# EAGLE schematic board_L2 (EAGLE 4.16)
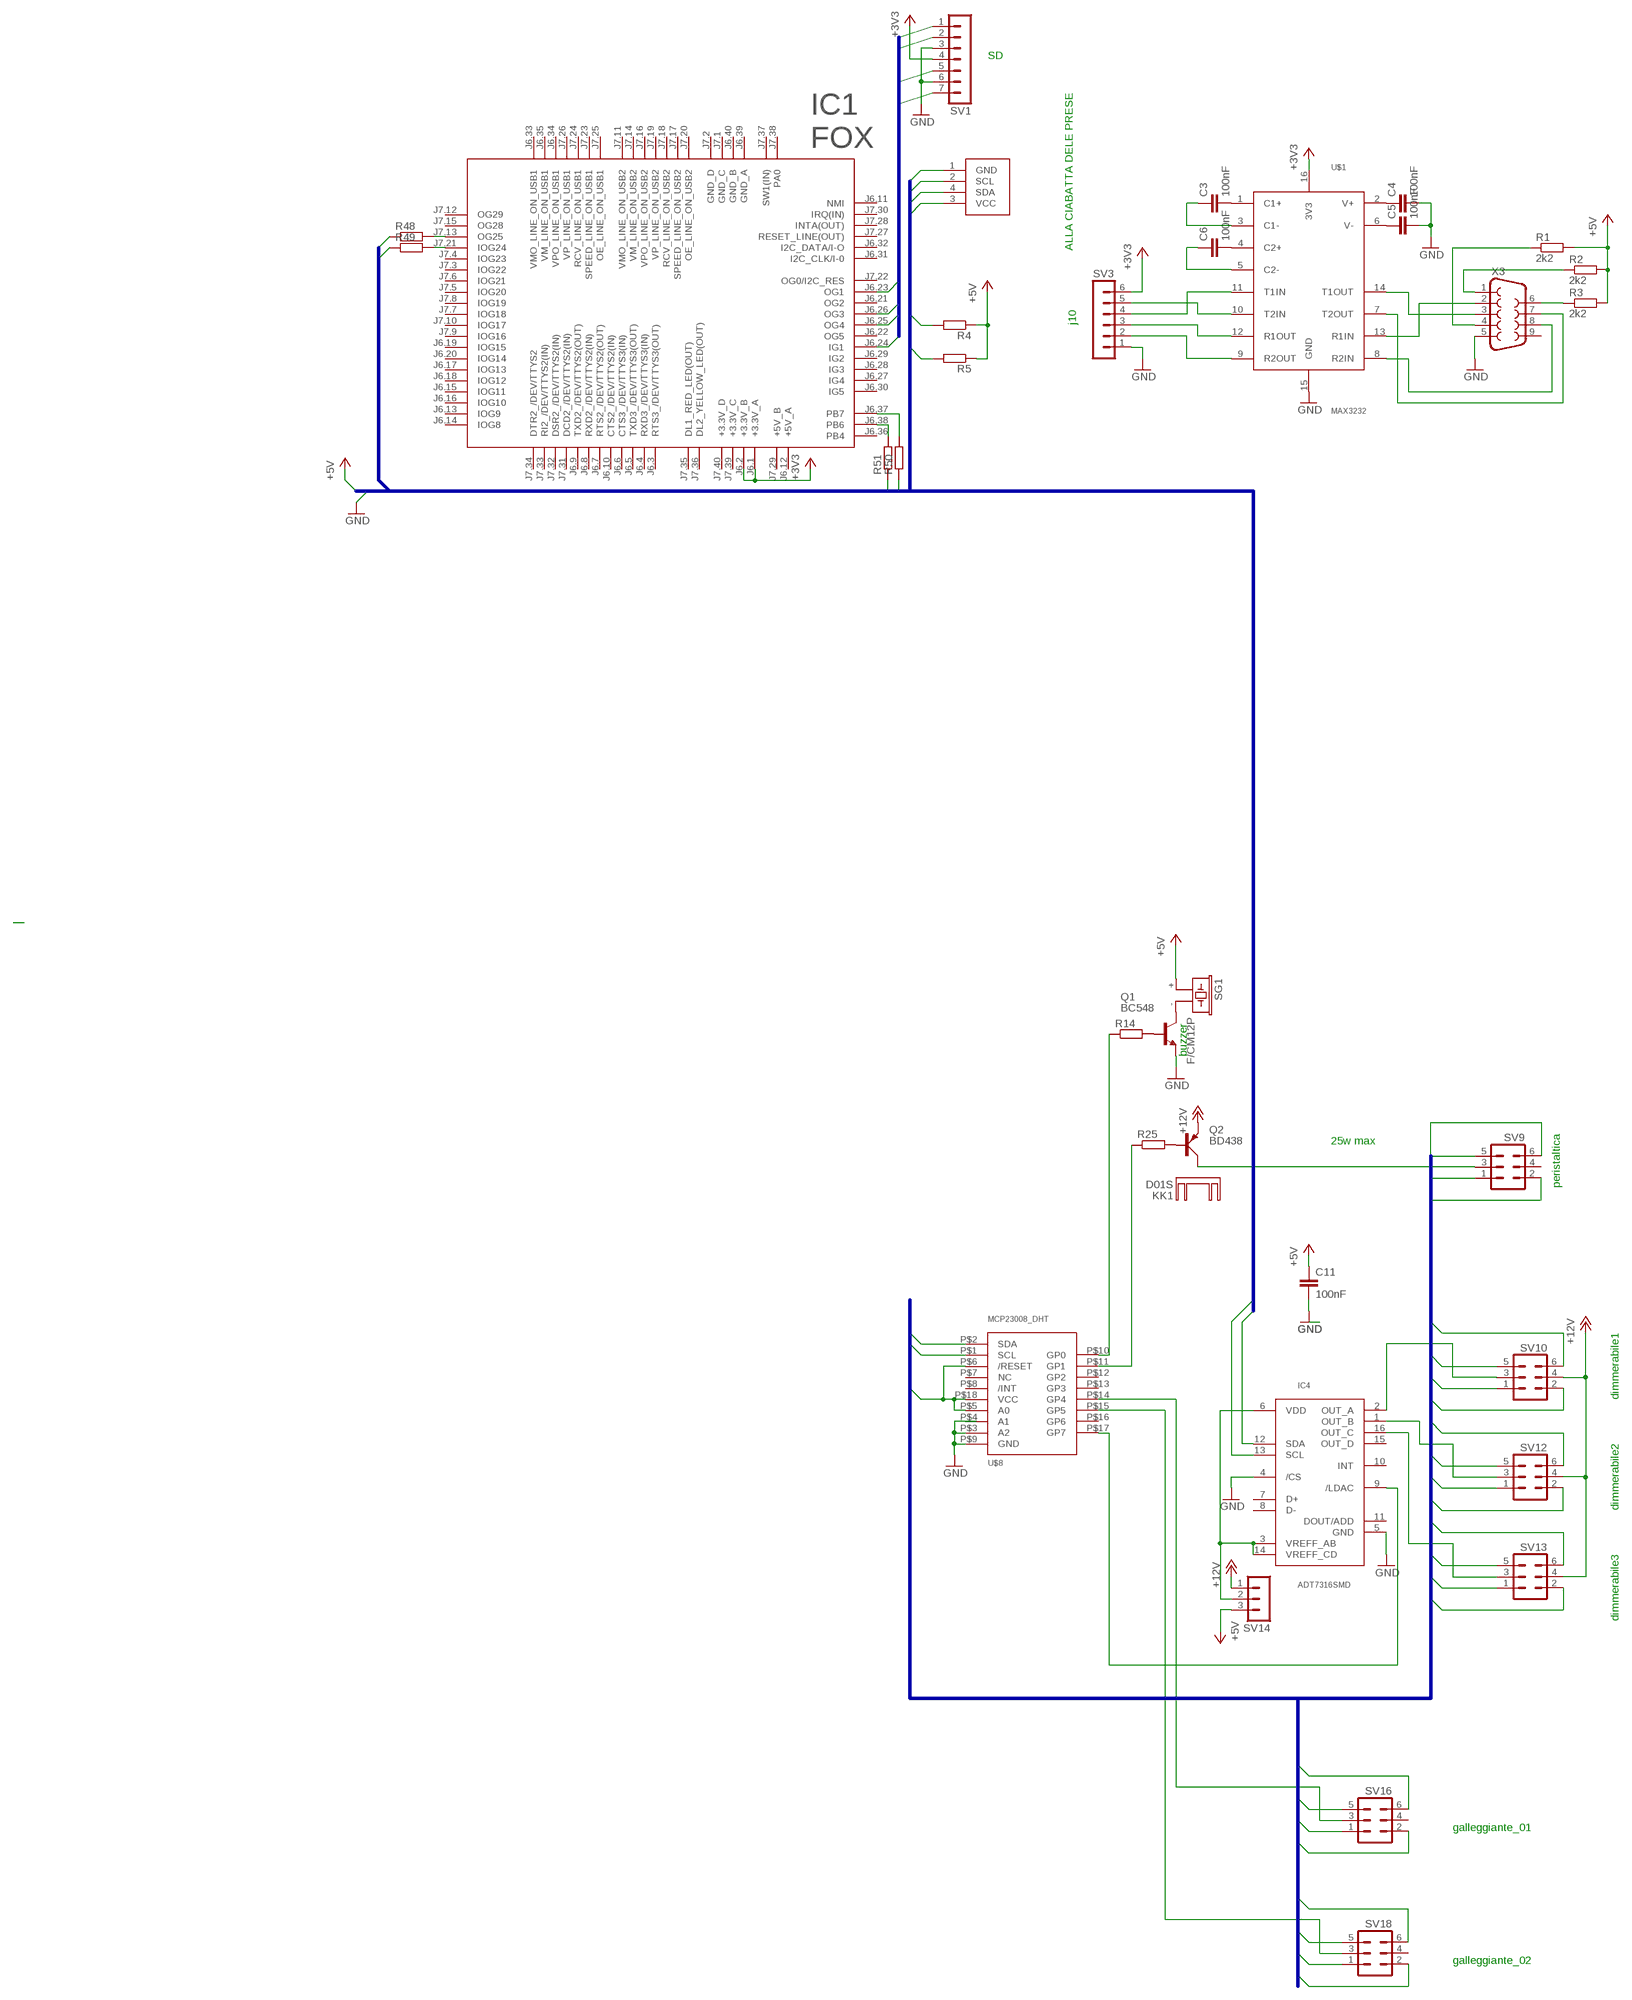
[diagram p0: schematic, sheet 1]

## Parts
C3  100nF  C-EUC0402  [C0402]
C4  100nF  C-EUC0402  [C0402]
C5  100nF  C-EUC0402  [C0402]
C6  100nF  C-EUC0402  [C0402]
C11  100nF  C-EUC0402  [C0402]
IC1  FOX  [FOX]
IC4  ADT7316SMD  [ADT7318SMD]
KK1  D01S  [D01S]
Q1  BC548  [TO92-EBC]
Q2  BD438  [TO126AV]
R1  2k2  R-EU_0207/10  [0207/10]
R2  2k2  R-EU_0207/10  [0207/10]
R3  2k2  R-EU_0207/10  [0207/10]
R4  R-EU_R0805  [R0805]
R5  R-EU_R0805  [R0805]
R14  R-EU_0309/V  [0309V]
R25  R-EU_0207/5V  [0207/5V]
R48  R-EU_R0805  [R0805]
R49  R-EU_R0805  [R0805]
R50  R-EU_R0805  [R0805]
R51  R-EU_R0805  [R0805]
SG1  F/CM12P  [F/CM12P]
SV1  MA07-1  [MA07-1]
SV3  MA06-1  [MA06-1]
SV9  MA03-2  [MA03-2]
SV10  MA03-2  [MA03-2]
SV12  MA03-2  [MA03-2]
SV13  MA03-2  [MA03-2]
SV14  MA03-1  [MA03-1]
SV16  MA03-2  [MA03-2]
SV18  MA03-2  [MA03-2]
U$1  MAX3232  [MAX3232]
U$8  MCP23008_DHT  [MCP23008_DHT]
U$13  J-I2C  [J-I2C]
X3  F09H  [F09H]

## Nets
5V: SV9.5 SV10.5 SV12.5 SV13.5 SV16.5 SV18.5 U$8.P$5(A0) U$8.P$6(/RESET) U$8.P$18(VCC) U$13.3(VCC) ; supply symbol labelled +5V
+3V3: IC1.J6.1(+3.3V_A) IC1.J6.2(+3.3V_B) SV1.4 SV3.6 U$1.16(3V3)
+5V: C11.1 R1.2 R2.2 R3.2 R4.1 R5.1 SG1.+ SV14.3
+12V: Q2.E SV10.4 SV12.4 SV13.4 SV14.1
GND: C4.2 C5.2 C11.2 IC4.4(/CS) IC4.5(GND) Q1.E SV1.3 SV1.6 SV3.1 SV9.1 SV10.1 SV12.1 SV13.1 SV16.1 SV18.1 U$1.15(GND) U$8.P$3(A2) U$8.P$9(GND) U$13.1(GND) X3.5
N$1: R14.1 U$8.P$10(GP0)
N$11: SV18.3 U$8.P$15(GP5)
N$14: Q2.B R25.2
N$15: IC1.J7.13(OG25) R48.2
N$16: R25.1 U$8.P$11(GP1)
N$17: IC4.16(OUT_C) SV13.3
N$18: SV16.3 U$8.P$14(GP4)
N$19: Q2.C SV9.3
N$20: Q1.C SG1.-
N$21: IC4.3(VREFF_AB) IC4.6(VDD) IC4.14(VREFF_CD) SV14.2
N$23: IC4.2(OUT_A) SV10.3
N$25: IC4.9(/LDAC) U$8.P$17(GP7)
N$26: Q1.B R14.2
N$27: C3.2 U$1.1(C1+)
N$36: U$1.14(T1OUT) X3.3
N$39: C6.2 U$1.4(C2+)
N$40: U$1.13(R1IN) X3.2
N$41: C5.1 U$1.6(V-)
N$42: C3.1 U$1.3(C1-)
N$43: C4.1 U$1.2(V+)
N$44: C6.1 U$1.5(C2-)
N$45: U$1.8(R2IN) X3.8
N$46: U$1.7(T2OUT) X3.7
N$47: R2.1 X3.1
N$48: R1.1 X3.4
N$49: R3.1 X3.6
N$50: IC4.1(OUT_B) SV12.3
N$53: IC1.J7.21(IOG24) R49.2
N$54: IC1.J6.38(PB6) R51.2
N$55: SV3.4 U$1.11(T1IN)
N$56: SV3.3 U$1.12(R1OUT)
N$57: SV3.5 U$1.10(T2IN)
N$59: SV3.2 U$1.9(R2OUT)
N$61: IC1.J6.37(PB7) R50.2
SCL: IC4.13(SCL) R5.2 R48.1 R50.1 SV9.2 SV10.2 SV12.2 SV13.2 SV16.2 SV18.2 U$8.P$1(SCL) U$13.2(SCL)
SD1: IC1.J6.26(OG3) SV1.1
SD2: IC1.J6.25(OG4) SV1.2
SD5: IC1.J6.23(OG1) SV1.5
SD7: IC1.J6.24(IG1) SV1.7
SDA: IC4.12(SDA) R4.2 R49.1 R51.1 SV9.6 SV10.6 SV12.6 SV13.6 SV16.6 SV18.6 U$8.P$2(SDA) U$13.4(SDA)
Unconnected: IC1.J6.3(RTS3_/DEV/TTYS3(OUT)) IC1.J6.4(RXD3_/DEV/TTYS3(IN)) IC1.J6.5(TXD3_/DEV/TTYS3(OUT)) IC1.J6.6(CTS3_/DEV/TTYS3(IN)) IC1.J6.7(RTS2_/DEV/TTYS2(OUT)) IC1.J6.8(RXD2_/DEV/TTYS2(IN)) IC1.J6.9(TXD2_/DEV/TTYS2(OUT)) IC1.J6.10(CTS2_/DEV/TTYS2(IN)) IC1.J6.11(NMI) IC1.J6.12(+5V_A) IC1.J6.13(IOG9) IC1.J6.14(IOG8) IC1.J6.15(IOG11) IC1.J6.16(IOG10) IC1.J6.17(IOG13) IC1.J6.18(IOG12) IC1.J6.19(IOG15) IC1.J6.20(IOG14) IC1.J6.21(OG2) IC1.J6.22(OG5) IC1.J6.27(IG4) IC1.J6.28(IG3) IC1.J6.29(IG2) IC1.J6.30(IG5) IC1.J6.31(I2C_CLK/I-0) IC1.J6.32(I2C_DATA/I-O) IC1.J6.33(VMO_LINE_ON_USB1) IC1.J6.34(VPO_LINE_ON_USB1) IC1.J6.35(VM_LINE_ON_USB1) IC1.J6.36(PB4) IC1.J6.39(GND_A) IC1.J6.40(GND_B) IC1.J7.1(GND_C) IC1.J7.2(GND_D) IC1.J7.3(IOG22) IC1.J7.4(IOG23) IC1.J7.5(IOG20) IC1.J7.6(IOG21) IC1.J7.7(IOG18) IC1.J7.8(IOG19) IC1.J7.9(IOG16) IC1.J7.10(IOG17) IC1.J7.11(VMO_LINE_ON_USB2) IC1.J7.12(OG29) IC1.J7.14(VM_LINE_ON_USB2) IC1.J7.15(OG28) IC1.J7.16(VPO_LINE_ON_USB2) IC1.J7.17(SPEED_LINE_ON_USB2) IC1.J7.18(RCV_LINE_ON_USB2) IC1.J7.19(VP_LINE_ON_USB2) IC1.J7.20(OE_LINE_ON_USB2) IC1.J7.22(OG0/I2C_RES) IC1.J7.23(SPEED_LINE_ON_USB1) IC1.J7.24(RCV_LINE_ON_USB1) IC1.J7.25(OE_LINE_ON_USB1) IC1.J7.26(VP_LINE_ON_USB1) IC1.J7.27(RESET_LINE(OUT)) IC1.J7.28(INTA(OUT)) IC1.J7.29(+5V_B) IC1.J7.30(IRQ(IN)) IC1.J7.31(DCD2_/DEV/TTYS2(IN)) IC1.J7.32(DSR2_/DEV/TTYS2(IN)) IC1.J7.33(RI2_/DEV/TTYS2(IN)) IC1.J7.34(DTR2_/DEV/TTYS2) IC1.J7.35(DL1_RED_LED(OUT)) IC1.J7.36(DL2_YELLOW_LED(OUT)) IC1.J7.37(SW1(IN)) IC1.J7.38(PA0) IC1.J7.39(+3.3V_C) IC1.J7.40(+3.3V_D) IC4.7(D+) IC4.8(D-) IC4.10(INT) IC4.11(DOUT/ADD) IC4.15(OUT_D) SV9.4 SV16.4 SV18.4 U$8.P$4(A1) U$8.P$7(NC) U$8.P$8(/INT) U$8.P$12(GP2) U$8.P$13(GP3) U$8.P$16(GP6) X3.9

## Buses
BUS:SDA,SCL,GND,5V
SD[1..7]

## Notes on the sheet
- SD
- ALLA CIABATTA DELE PRESE
- j10
- buzzer
- peristaltica
- 25w max
- dimmerabile1
- dimmerabile2
- dimmerabile3
- galleggiante_01
- galleggiante_02

## Library data of the parts
C3-C6 C11 = rcl:C-EU: CAPACITOR, European symbol
IC1 = aggiunte:FOX: FOXBOARD Un sistema linux embedded completo www.acmesystem.it
IC4 = aggiunte:ADT7316SMD: ADT7318 smd I2C DAC 4 Ch
KK1 = heatsink:D01S: HEATSINK distributor Schukat
Q1 = transistor-npn:BC548*: NPN Transistor
Q2 = transistor-power:BD438: PNP TRANSISTOR
R1-R5 R14 R25 R48-R51 = rcl:R-EU_: RESISTOR, European symbol
SG1 = buzzer:F/CM12P: BUZZER Source: Buerklin
SV1 = con-lstb:MA07-1: PIN HEADER
SV3 = con-lstb:MA06-1: PIN HEADER
SV9 SV10 SV12 SV13 SV16 SV18 = con-lstb:MA03-2: PIN HEADER
SV14 = con-lstb:MA03-1: PIN HEADER
U$1 = aggiunte:MAX3232: MAX3232 3.3v rs232 transceiver @ 5v supply
U$8 = aggiunte:MCP23008_DHT: MCP23008 I2C EXPANDER 8 Ch
U$13 = aggiunte:J-I2C: connettore 4polare telefonico usatro x i2c
X3 = con-subd:F09: SUB-D

## Net classes
0 default: width 0.61 mm